# EAGLE design buttonPCB_schematic (EAGLE 9.6.2)
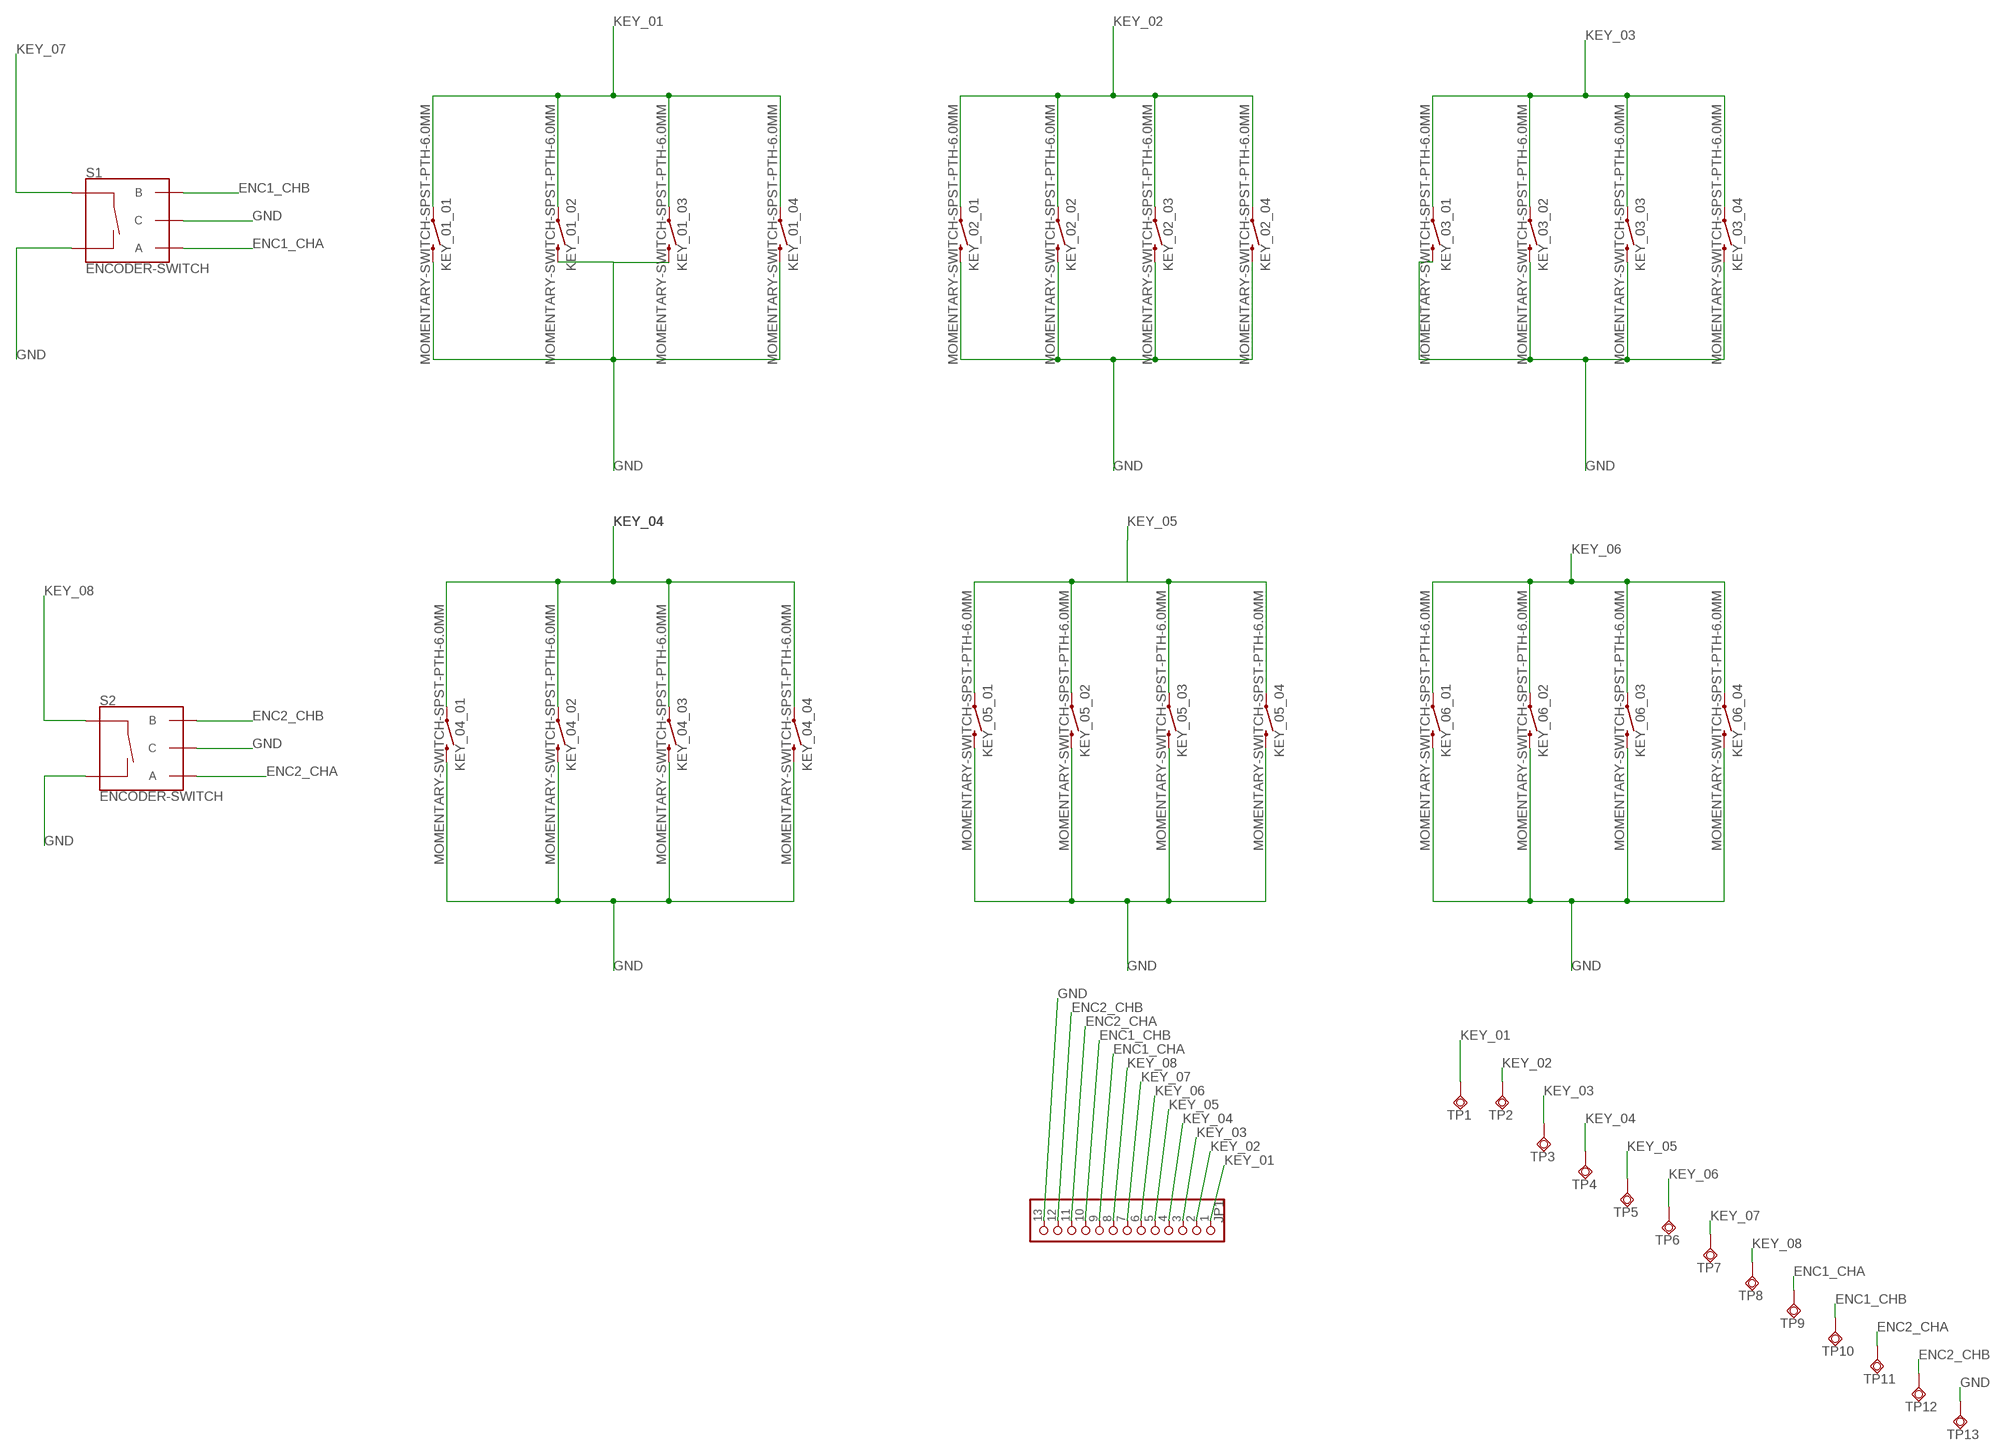
[diagram p0: schematic, sheet 1]

## Parts
JP1  PINHD-1X13  [1X13]
KEY_01_01  MOMENTARY-SWITCH-SPST-PTH-6.0MM  [TACTILE_SWITCH_PTH_6.0MM]
KEY_01_02  MOMENTARY-SWITCH-SPST-PTH-6.0MM  [TACTILE_SWITCH_PTH_6.0MM]
KEY_01_03  MOMENTARY-SWITCH-SPST-PTH-6.0MM  [TACTILE_SWITCH_PTH_6.0MM]
KEY_01_04  MOMENTARY-SWITCH-SPST-PTH-6.0MM  [TACTILE_SWITCH_PTH_6.0MM]
KEY_02_01  MOMENTARY-SWITCH-SPST-PTH-6.0MM  [TACTILE_SWITCH_PTH_6.0MM]
KEY_02_02  MOMENTARY-SWITCH-SPST-PTH-6.0MM  [TACTILE_SWITCH_PTH_6.0MM]
KEY_02_03  MOMENTARY-SWITCH-SPST-PTH-6.0MM  [TACTILE_SWITCH_PTH_6.0MM]
KEY_02_04  MOMENTARY-SWITCH-SPST-PTH-6.0MM  [TACTILE_SWITCH_PTH_6.0MM]
KEY_03_01  MOMENTARY-SWITCH-SPST-PTH-6.0MM  [TACTILE_SWITCH_PTH_6.0MM]
KEY_03_02  MOMENTARY-SWITCH-SPST-PTH-6.0MM  [TACTILE_SWITCH_PTH_6.0MM]
KEY_03_03  MOMENTARY-SWITCH-SPST-PTH-6.0MM  [TACTILE_SWITCH_PTH_6.0MM]
KEY_03_04  MOMENTARY-SWITCH-SPST-PTH-6.0MM  [TACTILE_SWITCH_PTH_6.0MM]
KEY_04_01  MOMENTARY-SWITCH-SPST-PTH-6.0MM  [TACTILE_SWITCH_PTH_6.0MM]
KEY_04_02  MOMENTARY-SWITCH-SPST-PTH-6.0MM  [TACTILE_SWITCH_PTH_6.0MM]
KEY_04_03  MOMENTARY-SWITCH-SPST-PTH-6.0MM  [TACTILE_SWITCH_PTH_6.0MM]
KEY_04_04  MOMENTARY-SWITCH-SPST-PTH-6.0MM  [TACTILE_SWITCH_PTH_6.0MM]
KEY_05_01  MOMENTARY-SWITCH-SPST-PTH-6.0MM  [TACTILE_SWITCH_PTH_6.0MM]
KEY_05_02  MOMENTARY-SWITCH-SPST-PTH-6.0MM  [TACTILE_SWITCH_PTH_6.0MM]
KEY_05_03  MOMENTARY-SWITCH-SPST-PTH-6.0MM  [TACTILE_SWITCH_PTH_6.0MM]
KEY_05_04  MOMENTARY-SWITCH-SPST-PTH-6.0MM  [TACTILE_SWITCH_PTH_6.0MM]
KEY_06_01  MOMENTARY-SWITCH-SPST-PTH-6.0MM  [TACTILE_SWITCH_PTH_6.0MM]
KEY_06_02  MOMENTARY-SWITCH-SPST-PTH-6.0MM  [TACTILE_SWITCH_PTH_6.0MM]
KEY_06_03  MOMENTARY-SWITCH-SPST-PTH-6.0MM  [TACTILE_SWITCH_PTH_6.0MM]
KEY_06_04  MOMENTARY-SWITCH-SPST-PTH-6.0MM  [TACTILE_SWITCH_PTH_6.0MM]
S1  ENCODER-SWITCH  [ROTARY_ENC_PLAIN]
S2  ENCODER-SWITCH  [ROTARY_ENC_PLAIN]
TP1  TPSQTP18SQ  [TP18SQ]
TP2  TPSQTP18SQ  [TP18SQ]
TP3  TPSQTP18SQ  [TP18SQ]
TP4  TPSQTP18SQ  [TP18SQ]
TP5  TPSQTP18SQ  [TP18SQ]
TP6  TPSQTP18SQ  [TP18SQ]
TP7  TPSQTP18SQ  [TP18SQ]
TP8  TPSQTP18SQ  [TP18SQ]
TP9  TPSQTP18SQ  [TP18SQ]
TP10  TPSQTP18SQ  [TP18SQ]
TP11  TPSQTP18SQ  [TP18SQ]
TP12  TPSQTP18SQ  [TP18SQ]
TP13  TPSQTP18SQ  [TP18SQ]

## Nets
ENC1_CHA: JP1.9 S1.A TP9.TP
ENC1_CHB: JP1.10 S1.B TP10.TP
ENC2_CHA: JP1.11 S2.A TP11.TP
ENC2_CHB: JP1.12 S2.B TP12.TP
GND: JP1.13 KEY_01_01.3 KEY_01_02.3 KEY_01_03.3 KEY_01_04.3 KEY_02_01.3 KEY_02_02.3 KEY_02_03.3 KEY_02_04.3 KEY_03_01.3 KEY_03_02.3 KEY_03_03.3 KEY_03_04.3 KEY_04_01.3 KEY_04_02.3 KEY_04_03.3 KEY_04_04.3 KEY_05_01.3 KEY_05_02.3 KEY_05_03.3 KEY_05_04.3 KEY_06_01.3 KEY_06_02.3 KEY_06_03.3 KEY_06_04.3 S1.C S1.SW- S2.C S2.SW- TP13.TP
KEY_01: JP1.1 KEY_01_01.1 KEY_01_02.1 KEY_01_03.1 KEY_01_04.1 TP1.TP
KEY_02: JP1.2 KEY_02_01.1 KEY_02_02.1 KEY_02_03.1 KEY_02_04.1 TP2.TP
KEY_03: JP1.3 KEY_03_01.1 KEY_03_02.1 KEY_03_03.1 KEY_03_04.1 TP3.TP
KEY_04: JP1.4 KEY_04_01.1 KEY_04_02.1 KEY_04_03.1 KEY_04_04.1 TP4.TP
KEY_05: JP1.5 KEY_05_01.1 KEY_05_02.1 KEY_05_03.1 KEY_05_04.1 TP5.TP
KEY_06: JP1.6 KEY_06_01.1 KEY_06_02.1 KEY_06_03.1 KEY_06_04.1 TP6.TP
KEY_07: JP1.7 S1.SW+ TP7.TP
KEY_08: JP1.8 S2.SW+ TP8.TP

## Library data of the parts
JP1 = pinhead:PINHD-1X13: PIN HEADER
KEY_01_01-KEY_01_04 KEY_02_01-KEY_02_04 KEY_03_01-KEY_03_04 KEY_04_01-KEY_04_04 KEY_05_01-KEY_05_04 KEY_06_01-KEY_06_04 = SparkFun-Switches:MOMENTARY-SWITCH-SPST: Momentary Switch (Pushbutton) - SPST Normally-open (NO) SPST momentary switches (buttons, pushbuttons). Variants PTH-12MM - 12mm square, through-hole Momentary Pushbutton Switch - 12mm Square <https://www.sparkfun.com/products/9190> (COM-09190) PTH-6.0MM, PTH-6.0MM-KIT - 6.0mm square, through-hole Mini Pushbutton Switch <https://www.sparkfun.com/products/97> (COM-00097) KIT package intended for soldering kit's - only one side of pads' copper is exposed. PTH-RIGHT-ANGLE-KIT - Right-angle, through-hole Right Angle Tactile Button <https://www.sparkfun.com/products/10791> - Used on SparkFun BigTime Watch Kit <https://www.sparkfun.com/products/11734> SMD-12MM - 12mm square, surface-mount Tactile Button - SMD (12mm) <https://www.sparkfun.com/products/12993> (COM-12993) Used on SparkFun PicoBoard <https://www.sparkfun.com/products/11888> SMD-4.5MM - 4.5mm Square Trackball Switch Used on SparkFun Blackberry Trackballer Breakout <https://www.sparkfun.com/products/13169> SMD-4.6MMX2.8MM - 4.60mm x 2.80mm, surface mount Used on SparkFun SAMD21 Mini Breakout <https://www.sparkfun.com/products/13664> SMD-5.2MM, SMD-5.2-REDUNDANT - 5.2mm square, surface-mount Mini Pushbutton Switch - SMD <https://www.sparkfun.com/products/8720> (COM-08720) Used on Arduino Pro Mini <https://www.sparkfun.com/products/11114> REDUNDANT package connects both switch circuits together SMD-6.0X3.5MM - 6.0 x 3.5mm, surface mount Momentary Reset Switch SMD <https://www.sparkfun.com/products/8229> (COM-08229) SMD-6.2MM-TALL - 6.2mm square, surface mount Tactile Button - SMD (6mm) <https://www.sparkfun.com/products/12992> Used on SparkFun Digital Sandbox <https://www.sparkfun.com/products/12651> SMD-RIGHT-ANGLE - Right-angle, surface mount Used on SparkFun Block for Intel® Edison - Arduino <https://www.sparkfun.com/products/13036>; PROD_ID: SWCH-08441; SF_SKU: COM-00097
S1 S2 = SparkFun-Switches:ENCODER-SWITCH: Rotary Encoder w/ Select Switch Encoders rotate similarly to potentiometers, but they’re different from potentiometers in that an encoder has full rotation without limits. They output gray code so that you can tell how much and in which direction the encoder has been turned. This encoder includes a push-down select switch built into the shaft. SparkFun Products Rotary Encoder <https://www.sparkfun.com/products/9117> (COM-09117); SF_SKU: COM-09117
TP1-TP13 = testpad:TPSQ: Test pad

## Board
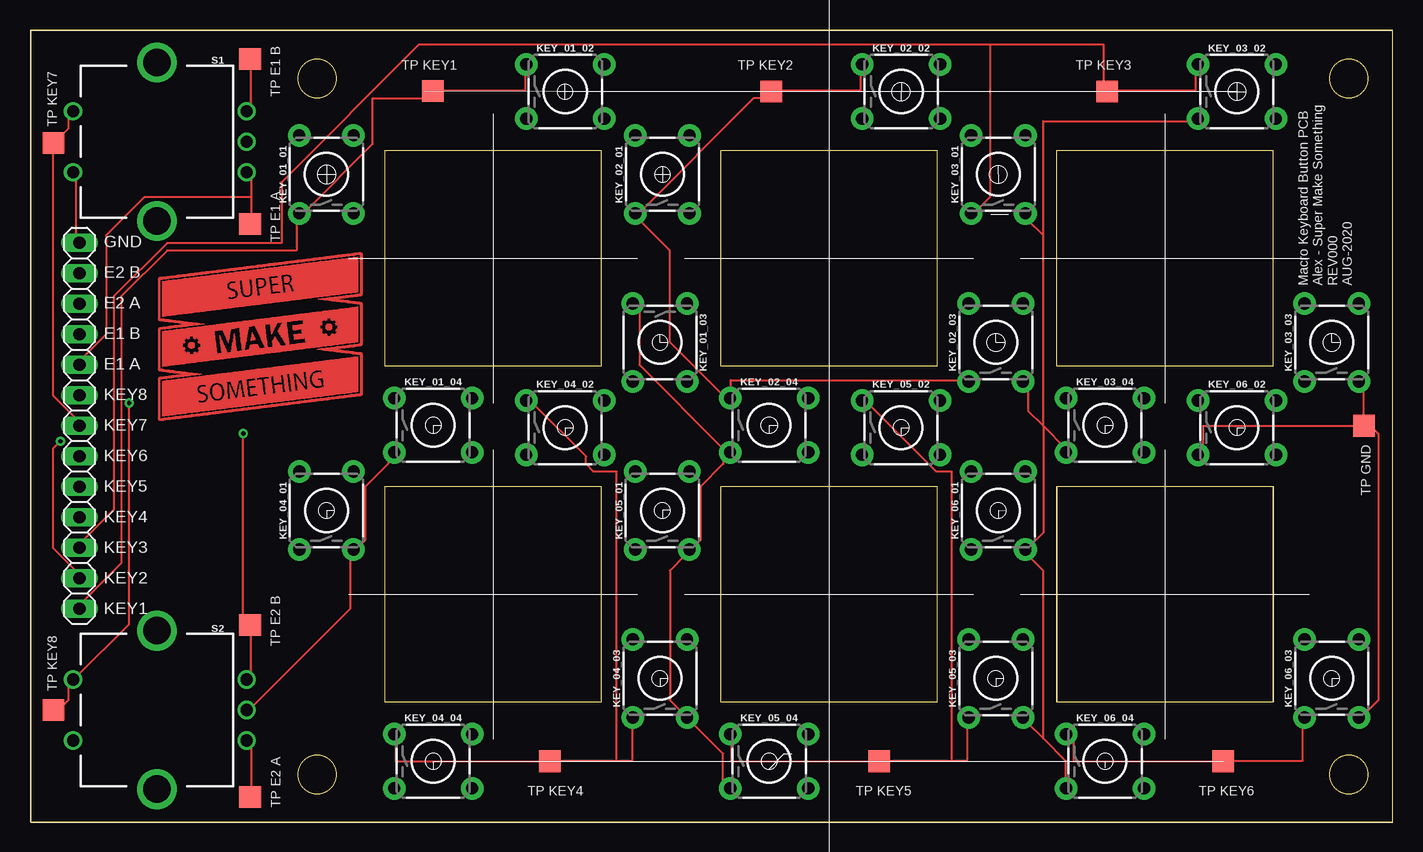
[diagram p1: board, top side]
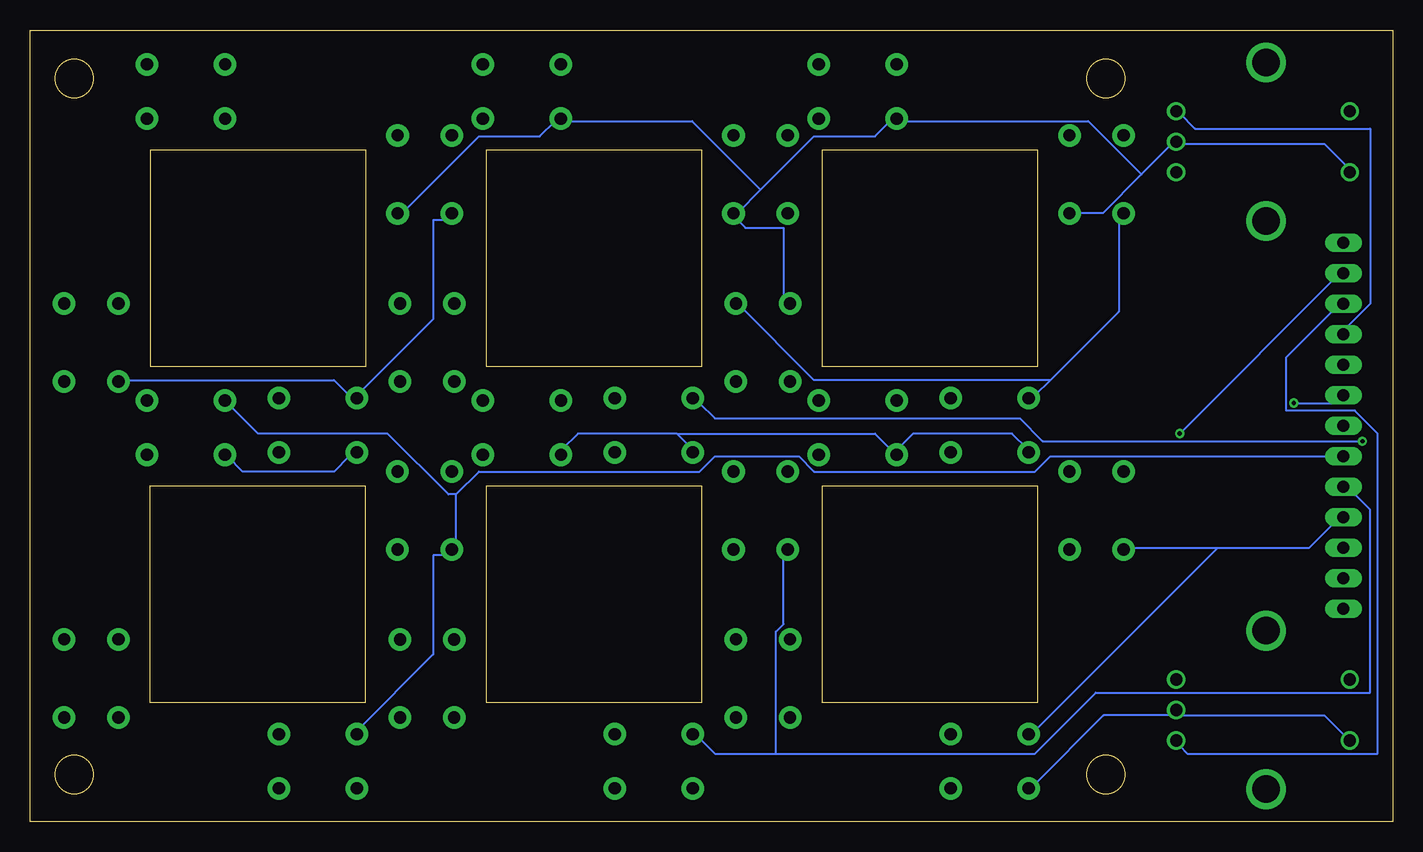
[diagram p2: board, bottom side, seen from below]

Size 113.62 x 66 mm. Coordinates in mm from the lower left corner, seen from the top.
Outline: 85.62,37.96 85.62,55.96 103.62,55.96 103.62,37.96 85.62,37.96
Outline: 29.62,37.96 29.62,55.96 47.62,55.96 47.62,37.96 29.62,37.96
Outline: 57.62,37.96 57.62,55.96 75.62,55.96 75.62,37.96 57.62,37.96
Outline: 113.62,65.96 0,66 0,0.04 113.62,0 113.62,65.96
Outline: 29.62,9.98 29.62,27.98 47.62,27.98 47.62,9.96 29.62,9.98
Outline: 57.62,9.96 57.62,27.96 75.62,27.96 75.62,9.96 57.62,9.96
Outline: 85.63,9.97 85.63,27.97 103.63,27.97 103.63,9.97 85.63,9.97
Outline: circle at 109.94,61.96 radius 1.6
Outline: circle at 23.94,3.96 radius 1.6
Outline: circle at 109.94,3.96 radius 1.6
Outline: circle at 23.94,61.96 radius 1.6
Copper layers (1*16): Top 0.035mm / dielectric 1.5mm / Bottom 0.035mm
Design rules "default": minimum track width 6mil, minimum drill 0.35mm, track to track 6mil, track to pad 6mil, pad to pad 6mil, via to via 6mil, smd to smd 6mil, copper to edge 40mil, drill to drill 6mil, minimum pad ring 10mil, minimum via ring 8mil, stop-mask expansion 4mil, vias tented up to drill 0mil, thermal gap 10mil

### Footprints (pad centres in the part's own frame; a part is rotated, then mirrored left to right if it is on the bottom)
1X13 = drill 1.016 long: 1 -15.24,0; 2 -12.7,0; 3 -10.16,0; 4 -7.62,0; 5 -5.08,0; 6 -2.54,0; 7 0,0; 8 2.54,0; 9 5.08,0; 10 7.62,0; 11 10.16,0; 12 12.7,0; 13 15.24,0
TACTILE_SWITCH_PTH_6.0MM = drill 1.016 pad 1.88: 1 -3.251,2.261; 2 3.251,2.261; 3 -3.251,-2.261; 4 3.251,-2.261
ROTARY_ENC_PLAIN = drill 1.016: A 7.493,-2.54; B 7.493,2.54; C 7.493,0; SW+ -6.985,2.54; SW- -6.985,-2.54 | drill 2.286: P$3 0,6.604; P$4 0,-6.604
TP18SQ = smd 1.8 x 1.8: TP 0,0

### Placement (x,y rotation side)
JP1  4.13,33.02 90 top
KEY_01_01  24.71,53.97 90 top
KEY_01_02  44.62,60.87 0 top
KEY_01_03  52.52,39.96 270 top
KEY_01_04  33.62,33.06 0 top
KEY_02_01  52.72,53.97 90 top
KEY_02_02  72.63,60.87 0 top
KEY_02_03  80.51,39.96 90 top
KEY_02_04  61.62,33.06 0 top
KEY_03_01  80.72,53.97 90 top
KEY_03_02  100.61,60.87 0 top
KEY_03_03  108.52,39.96 90 top
KEY_03_04  89.62,33.06 0 top
KEY_04_01  24.71,25.96 90 top
KEY_04_02  44.62,32.86 0 top
KEY_04_03  52.52,11.96 90 top
KEY_04_04  33.62,5.06 0 top
KEY_05_01  52.71,25.96 90 top
KEY_05_02  72.61,32.86 0 top
KEY_05_03  80.52,11.96 90 top
KEY_05_04  61.62,5.06 0 top
KEY_06_01  80.72,25.96 90 top
KEY_06_02  100.62,32.86 0 top
KEY_06_03  108.52,11.96 90 top
KEY_06_04  89.62,5.06 0 top
S1  10.58,56.69 0 top
S2  10.58,9.33 0 top
TP1  33.58,60.9 0 top
TP2  61.8,60.87 0 top
TP3  89.78,60.87 0 top
TP4  43.32,5.06 0 top
TP5  70.79,5.06 0 top
TP6  99.46,5.06 0 top
TP7  1.97,56.57 0 top
TP8  1.97,9.32 0 top
TP9  18.36,49.83 0 top
TP10  18.36,63.58 0 top
TP11  18.36,2.1 0 top
TP12  18.36,16.41 0 top
TP13  111.21,33.02 0 top

### Tracks (layer width: path | path; a pad name or v marks a point on that pad's centre or on a via)
ENC1_CHA
  Top 0.152: 18.42,52.06 18.42,53.96 S1.A | 18.42,52.06 18.42,50.15 TP9.TP | 18.42,52.06 9.53,52.06 6.35,48.88 6.35,40.63 4.45,38.72 JP1.9
ENC1_CHB
  Top 0.152: TP10.TP 18.42,63.49 18.42,59.68 S1.B
  Bottom 0.152: JP1.10 3.81,41.26 1.91,43.17 1.91,57.77 16.51,57.77 17.78,59.04 S1.B
ENC2_CHA
  Top 0.152: TP11.TP 18.42,2.53 18.42,6.34 S2.A
  Bottom 0.152: JP1.11 4.45,43.17 8.89,38.72 8.89,34.28 3.18,34.28 1.27,32.37 1.27,5.7 17.15,5.7 17.78,6.34 S2.A
ENC2_CHB  (via drill 0.35)
  Top 0.152: S2.B 18.42,12.05 18.42,15.86 TP12.TP 17.78,16.5 v17.78,32.37
  Bottom 0.152: v17.78,32.37 4.45,45.71 JP1.12
GND
  Top 0.152: KEY_01_04.3 29.85,30.47 29.85,29.83 27.94,27.93 27.94,23.48 27.31,22.85 KEY_04_01.3 26.67,22.21 26.67,17.77 18.42,9.51 S2.C | KEY_05_04.3 57.79,3.16 57.79,5.7 55.25,8.24 KEY_04_03.3 54.61,8.88 53.34,10.15 53.34,20.94 54.61,22.21 KEY_05_01.3 55.25,22.85 55.88,23.48 55.88,27.93 57.79,29.83 57.79,30.47 KEY_02_04.3 57.79,31.1 50.8,38.09 50.8,43.17 KEY_01_03.3 | JP1.13 3.81,48.88 3.81,53.96 S1.SW- | TP13.TP 111.13,33.64 111.13,36.18 KEY_03_03.3 | KEY_06_03.3 111.13,8.88 112.4,10.15 112.4,32.37 111.76,33.01 TP13.TP | 84.46,6.97 86.36,5.07 86.36,3.16 KEY_06_04.3 | 84.46,6.97 83.19,8.24 KEY_05_03.3 | 84.46,6.97 84.46,20.94 83.19,22.21 KEY_06_01.3 83.19,22.85 84.46,24.12 84.46,33.01 | 84.46,33.01 83.19,34.28 83.19,36.18 KEY_02_03.3 | 84.46,33.01 86.36,31.1 KEY_03_04.3 | 84.46,48.88 83.19,50.15 KEY_03_01.3 | 84.46,33.01 84.46,48.88 | 84.46,48.88 84.46,58.41 97.16,58.41 KEY_03_02.3 | TP13.TP 111.13,33.01 97.79,33.01 97.79,31.1 KEY_06_02.3
  Bottom 0.152: S2.SW- 3.81,6.97 5.72,8.88 17.78,8.88 S2.C 18.42,8.88 24.13,8.88 29.85,3.16 KEY_04_04.3 | KEY_01_04.3 30.48,31.1 31.75,32.37 40.01,32.37 41.28,31.1 KEY_04_02.3 41.91,31.1 43.18,32.37 59.69,32.37 | 59.69,32.37 67.95,32.37 69.22,31.1 KEY_05_02.3 | 59.69,32.37 58.42,31.1 KEY_02_04.3 | 20.96,53.96 24.13,50.79 26.67,50.79 KEY_01_01.3 | 20.96,53.96 18.42,56.5 S1.C 17.78,56.5 5.72,56.5 3.81,54.6 S1.SW- | KEY_01_03.3 50.8,43.8 50.8,49.52 53.98,49.52 54.61,50.15 KEY_02_01.3 54.61,50.79 52.71,52.69 | 52.71,52.69 48.26,57.14 43.18,57.14 41.91,58.41 KEY_01_02.3 41.28,58.41 25.4,58.41 20.96,53.96 | KEY_06_02.3 97.16,30.47 95.89,29.2 88.27,29.2 87,30.47 KEY_03_04.3 | KEY_03_01.3 82.55,50.79 76.2,57.14 71.12,57.14 69.85,58.41 KEY_02_02.3 69.22,58.41 58.42,58.41 52.71,52.69
KEY_01
  Top 0.152: KEY_01_02.1 41.28,62.85 41.28,60.95 33.66,60.95 TP1.TP 33.02,60.31 28.58,60.31 28.58,56.5 22.86,50.79 KEY_01_01.1 22.23,50.15 22.23,47.61 11.43,47.61 7.62,43.8 7.62,21.58 4.45,18.4 JP1.1
  Bottom 0.152: 28.58,36.82 22.86,42.53 22.86,50.15 KEY_01_01.1 | 28.58,36.82 29.85,35.55 KEY_01_04.1 | 28.58,36.82 48.26,36.82 54.61,43.17 KEY_01_03.1
KEY_02  (via drill 0.35)
  Top 0.152: KEY_02_02.1 69.22,62.85 69.22,60.95 62.23,60.95 TP2.TP 61.6,60.31 60.33,60.31 50.8,50.79 KEY_02_01.1 50.8,50.15 53.34,47.61 53.34,39.99 57.79,35.55 KEY_02_04.1 58.42,35.55 58.42,36.82 78.11,36.82 KEY_02_03.1 | v2.54,31.74 1.91,31.1 1.91,22.85 3.81,20.94 JP1.2
  Bottom 0.152: v2.54,31.74 29.21,31.74 31.12,33.64 56.52,33.64 57.79,34.91 KEY_02_04.1
KEY_03
  Top 0.152: KEY_03_02.1 97.16,62.85 97.16,60.95 90.17,60.95 TP3.TP 89.54,60.95 89.54,64.76 80.01,64.76 | 80.01,64.76 32.39,64.76 20.96,53.33 20.96,48.25 11.43,48.25 6.99,43.8 6.99,26.02 4.45,23.48 JP1.3 | 80.01,64.76 80.01,52.06 78.74,50.79 KEY_03_01.1
  Bottom 0.152: KEY_03_03.1 106.05,36.82 88.27,36.82 87,35.55 KEY_03_04.1 86.36,35.55 80.01,41.9 80.01,50.15 78.74,50.15 KEY_03_01.1
KEY_04
  Top 0.152: 48.9,5.07 50.17,5.07 50.17,8.24 KEY_04_03.1 | 48.9,5.07 43.82,5.07 TP4.TP 43.18,5.07 30.48,5.07 30.48,6.97 KEY_04_04.1 | 48.9,5.07 48.9,29.2 46.99,29.2 46.36,29.83 46.36,30.47 41.91,34.91 KEY_04_02.1
  Bottom 0.152: 14.61,22.85 22.23,22.85 KEY_04_01.1 | 14.61,22.85 6.99,22.85 4.45,25.39 JP1.4 | 14.61,22.85 29.85,7.61 KEY_04_04.1
KEY_05
  Top 0.152: 76.84,5.07 78.11,5.07 78.11,8.24 KEY_05_03.1 | 76.84,5.07 71.12,5.07 TP5.TP 70.49,5.07 58.42,5.07 58.42,6.97 KEY_05_04.1 | 76.84,5.07 76.84,29.2 75.57,29.2 69.85,34.91 KEY_05_02.1
  Bottom 0.152: 51.44,5.7 56.52,5.7 57.79,6.97 KEY_05_04.1 | 51.44,5.7 29.85,5.7 24.77,10.78 1.91,10.78 1.91,26.02 3.81,27.93 JP1.5 | 51.44,5.7 51.44,15.86 50.8,16.5 50.8,22.21 KEY_05_01.1
KEY_06
  Top 0.152: KEY_06_03.1 106.05,8.24 106.05,5.07 99.7,5.07 TP6.TP 99.06,5.07 87,5.07 87,6.97 KEY_06_04.1
  Bottom 0.152: 78.11,27.29 76.2,29.2 57.79,29.2 56.52,30.47 49.53,30.47 48.26,29.2 29.85,29.2 28.58,30.47 4.45,30.47 JP1.6 | 78.11,27.29 78.11,22.85 KEY_06_01.1 78.74,22.21 80.01,22.21 80.01,13.96 86.36,7.61 KEY_06_04.1 | 78.11,27.29 78.74,27.29 83.82,32.37 94.62,32.37 97.16,34.91 KEY_06_02.1
KEY_07
  Top 0.152: S1.SW+ 3.18,59.04 3.18,57.77 2.54,57.14 TP7.TP 1.91,56.5 1.91,35.55 3.81,33.64 JP1.7
KEY_08  (via drill 0.35)
  Top 0.152: TP8.TP 2.54,9.51 3.18,10.15 3.18,11.42 S2.SW+ 3.81,12.05 8.26,16.5 v8.26,34.91
  Bottom 0.152: v8.26,34.91 5.08,34.91 4.45,35.55 JP1.8
(copper drawn outside any net)
  shapes: Top area x3961

### Text on the board
Top: D:/Documents/Super Make Something/Logos/PCB/pcbLogo2Color.bmp | D:/Documents/Super Make Something/Logos/PCB/pcbLogo2Color.bmp
tPlace: TP KEY1 | TP KEY2 | TP KEY3 | TP E1 B | TP KEY7 | GND | TP E1 A | E2 B | Macro Keyboard Button PCB / Alex - Super Make Something / REV000 / AUG-2020 | E2 A | E1 B | E1 A | KEY8 | KEY7 | KEY6 | KEY5 | TP GND | KEY4 | KEY3 | KEY2 | KEY1 | TP E2 B | TP KEY8 | TP KEY4 | TP KEY5 | TP KEY6 | TP E2 A